# Altium schematic sheet 电流电压转换.SchDoc
size A4
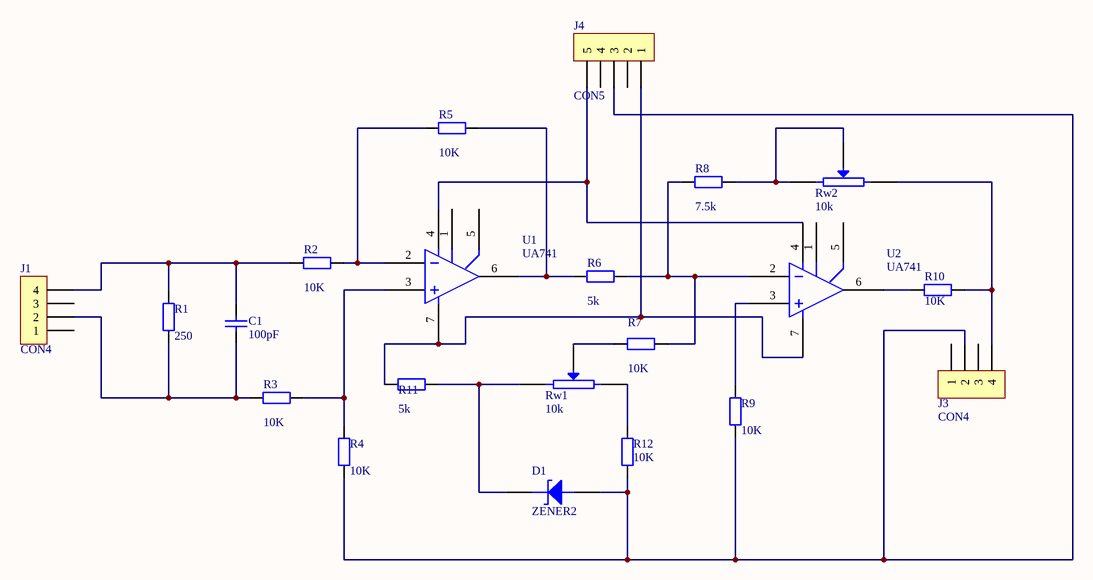
[diagram p0: 电流电压转换.SchDoc]

## Parts
C1  value 100pF  [RAD-0.1]  (hidden comment: Cap)
D1  ZENER2  [DIODE0.4]
J1  CON4  [SIP4]
J3  CON4  [SIP4]
J4  CON5  [POWER PLUG5]
R1  value 250  [AXIAL-0.4]  (hidden comment: Res2)
R2  value 10K  [AXIAL-0.4]  (hidden comment: Res2)
R3  value 10K  [AXIAL-0.4]  (hidden comment: Res2)
R4  value 10K  [AXIAL-0.4]  (hidden comment: Res2)
R5  value 10K  [AXIAL-0.4]  (hidden comment: Res2)
R6  value 5k  [AXIAL-0.4]  (hidden comment: Res2)
R7  value 10K  [AXIAL-0.4]  (hidden comment: Res2)
R8  value 7.5k  [AXIAL-0.4]  (hidden comment: Res2)
R9  value 10K  [AXIAL-0.4]  (hidden comment: Res2)
R10  value 10K  [AXIAL-0.4]  (hidden comment: Res2)
R11  value 5k  [AXIAL-0.4]  (hidden comment: Res2)
R12  value 10K  [AXIAL-0.4]  (hidden comment: Res2)
Rw1  10k  [RP3296]
Rw2  10k  [RP3296]
U1  UA741  [DIP-8]
U2  UA741  [DIP-8]

## Nets
NetC1_1: C1.1 J1.4 R1.2 R2.1
NetC1_2: C1.2 J1.2 R1.1 R3.1
NetD1_A: D1.A R11.2 Rw1.1
NetD1_K: D1.K J3.2 J4.3 R4.1 R9.1 R12.2
NetJ3_4: J3.4 R10.1 Rw2.2
NetJ4_1: J4.1 R11.1 U1.7 U2.7
NetJ4_5: J4.5 U1.4 U2.4
NetR2_2: R2.2 R5.1 U1.2
NetR3_2: R3.2 R4.2 U1.3
NetR5_2: R5.2 R6.1 U1.6
NetR6_2: R6.2 R7.2 R8.1 U2.2
NetR7_1: R7.1 Rw1.3(W)
NetR8_2: R8.2 Rw2.1 Rw2.3(W)
NetR9_2: R9.2 U2.3
NetR10_2: R10.2 U2.6
NetR12_1: R12.1 Rw1.2

Not connected (* = marked no-connect by the designer): J1 1 3; J3 1 3; J4 2 4; U1 1 5; U2 1 5

## Library data of the parts
C1 = Cap: Capacitor; Published: 8-Jun-2000; LatestRevisionDate: 17-Jul-2002; LatestRevisionNote: Re-released for DXP Platform.; PackageReference: RAD-0.3; Publisher: Altium Limited
D1 = ZENER2: Zener Diode
J1 J3 = CON4: Connector
J4 = CON5: Connector
R1-R12 = Res2: Resistor; Published: 8-Jun-2000; LatestRevisionDate: 17-Jul-2002; LatestRevisionNote: Re-released for DXP Platform.; PackageReference: AXIAL-0.4; Publisher: Altium Limited
Rw1 Rw2 = POT2: Potentiometer